# Altium schematic sheet Multiplexers.SchDoc
size A; DocumentNumber: 5; SheetNumber: 5; SheetTotal: 5
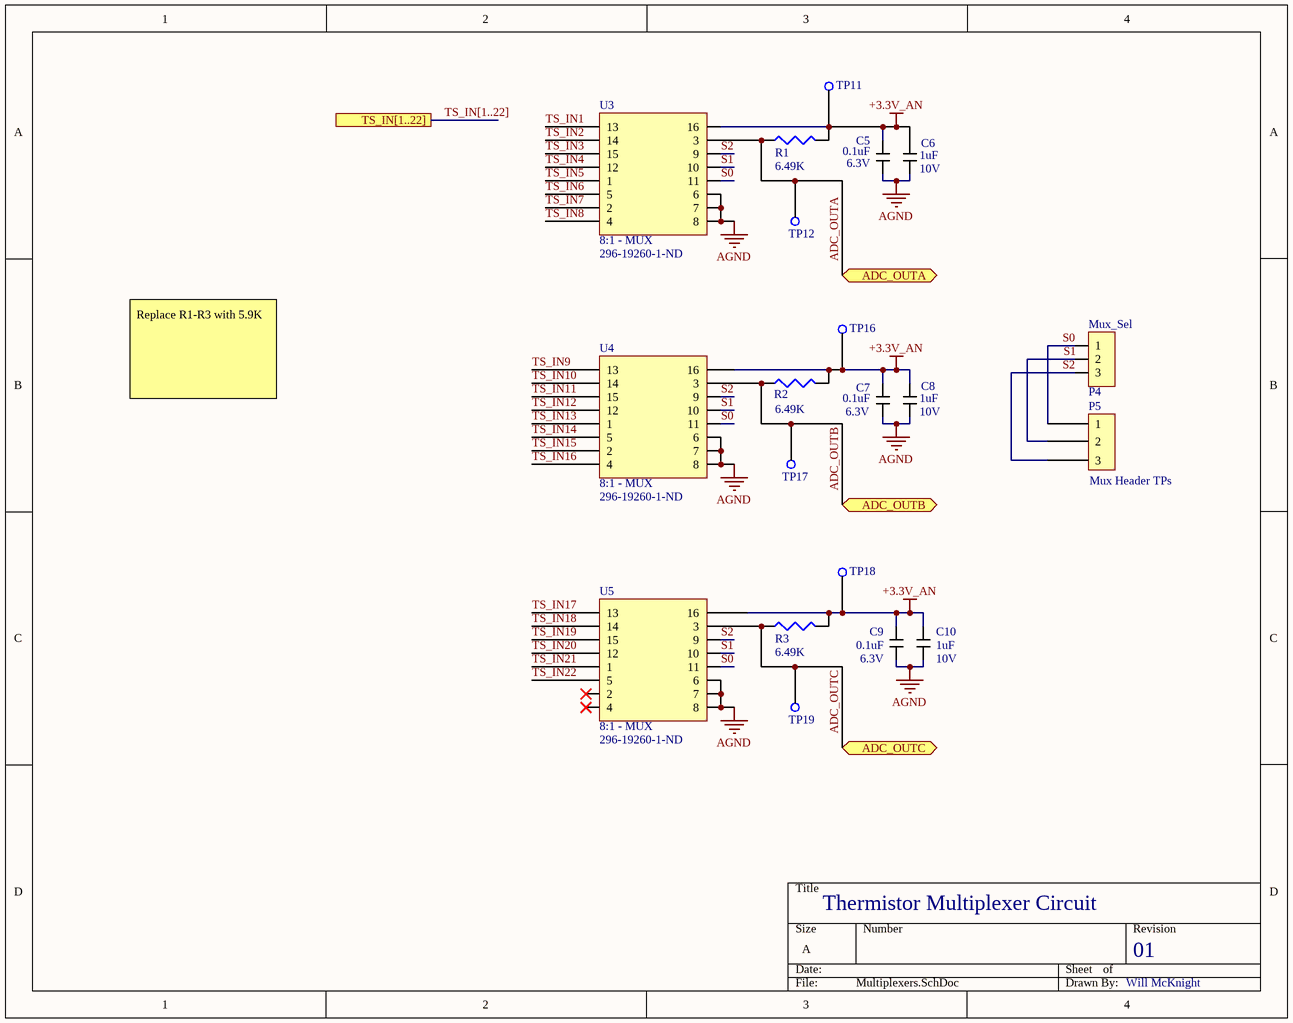
[diagram p0: Multiplexers.SchDoc]

## Parts
C5  0.1uF  Voltage Rating: 6.3V  [0.1uF Bypass Capacitor]
C6  Voltage Rating: 10V  [1uf_Samsung]  (hidden comment: 1uF)
C7  0.1uF  Voltage Rating: 6.3V  [0.1uF Bypass Capacitor]
C8  1uF  [1uf_Samsung]
C9  0.1uF  Voltage Rating: 6.3V  [0.1uF Bypass Capacitor]
C10  Voltage Rating: 10V  [1uf_Samsung]  (hidden comment: 1uF)
P4  Mux_Sel  [3-Screw-terminal-Mux-Select]
P5  3 POS Mux Select Header  [Mux Select 3 Pos Header Pin]  (value not drawn)
R1  Resistance: 6.49K  [RESC2012X06N]  (hidden comment: 6.49kOhm SMD Resistor)
R2  Resistance: 6.49K  [RESC2012X06N]  (hidden comment: 6.49kOhm SMD Resistor)
R3  Resistance: 6.49K  [RESC2012X06N]  (hidden comment: 6.49kOhm SMD Resistor)
TP11  Test Point  [Test Point]  (value not drawn)
TP12  Test Point  [Test Point]  (value not drawn)
TP16  Test Point  [Test Point]  (value not drawn)
TP17  Test Point  [Test Point]  (value not drawn)
TP18  Test Point  [Test Point]  (value not drawn)
TP19  Test Point  [Test Point]  (value not drawn)
U3  8:1 - MUX  Supplier Part Number 1: 296-19260-1-ND  [SOP127P600X175]
U4  8:1 - MUX  Supplier Part Number 1: 296-19260-1-ND  [SOP127P600X175]
U5  8:1 - MUX  Supplier Part Number 1: 296-19260-1-ND  [SOP127P600X175]

## Ports
ADC_OUTA (bidir), ADC_OUTB (bidir), ADC_OUTC (bidir), TS_IN[1..22]

## Nets
+3.3V_AN: C5.2 C6.2 C7.2 C8.2 C9.2 C10.2 R1.2 R2.2 R3.2 TP11.1 TP16.1 TP18.1 U3.16 U4.16 U5.16
AGND: C5.1 C6.1 C7.1 C8.1 C9.1 C10.1 U3.6 U3.7 U3.8 U4.6 U4.7 U4.8 U5.6 U5.7 U5.8
ADC_OUTA: R1.1 TP12.1 U3.3 ; port ADC_OUTA
ADC_OUTB: R2.1 TP17.1 U4.3 ; port ADC_OUTB
ADC_OUTC: R3.1 TP19.1 U5.3 ; port ADC_OUTC
S0: P4.1 P5.1 U3.11 U4.11 U5.11
S1: P4.2 P5.2 U3.10 U4.10 U5.10
S2: P4.3 P5.3 U3.9 U4.9 U5.9
TS_IN1: U3.13
TS_IN2: U3.14
TS_IN3: U3.15
TS_IN4: U3.12
TS_IN5: U3.1
TS_IN6: U3.5
TS_IN7: U3.2
TS_IN8: U3.4
TS_IN9: U4.13
TS_IN10: U4.14
TS_IN11: U4.15
TS_IN12: U4.12
TS_IN13: U4.1
TS_IN14: U4.5
TS_IN15: U4.2
TS_IN16: U4.4
TS_IN17: U5.13
TS_IN18: U5.14
TS_IN19: U5.15
TS_IN20: U5.12
TS_IN21: U5.1
TS_IN22: U5.5

Not connected (* = marked no-connect by the designer): U5 2* 4*

## Buses and harness runs
bus TS_IN[1..22] = port TS_IN[1..22]

## Notes on the sheet
- Replace R1-R3 with 5.9K
- (near C8) 10V
- (near P5) Mux Header TPs
- Thermistor Multiplexer Circuit
- 01
- Will McKnight

## Library data of the parts
C5 C7 C9 = 0.1uF Cap: 0.1uF Bypass Cap; Manufacturer: KEMET; Manufacturer Part Number: C0603C104K9RACTU; Dielectric Material: Ceramic; Tolerance: 10%; Dielectric: X7R; Dissipation Factor: 5%; Supplier 1: Digi-Key; Supplier Part Number 1: 399-15351-1-ND; RoHS: Yes; Mount: Surface Mount; Case/Package: 0603; Case Code (Imperial): 0603; Case Code (Metric): 1608; Min Operating Temperature: -55°C; Max Operating Temperature: 125°C; Package Quantity: 4000; Packaging: Tape and Reel; Voltage Rating (DC): 6.3V; Termination: SMD/SMT; Length: 1.6mm; Height: 0.8mm; Width: 0.8mm; Thickness: 0.034inch; ComponentLink1URL: https://datasheet.ciiva.com/13371/kem-c1002-x7r-smd-357932-13371879.pdf?src-supplier=Mouser; ComponentLink1Description: https://datasheet.ciiva.com/13371/kem-c1002-x7r-smd-357932-13371879.pdf?src-supplier=Mouser; Stock 1: 758; Pricing 1: 1=0.19000, 10=0.13800, 100=0.06480, 500=0.04546, 1000=0.03763 (USD)
C6 C10 = 1uF Samsung Cap: Manufacturer Part Number: CL10B105KP8NNNC; Tolerance: 10%; Dielectric: X7R; Supplier 1: Digi-Key; Supplier Part Number 1: 1276-1946-1-ND; Manufacturer: Samsung; Mount: Surface Mount; Case/Package: 0603; Case Code (Metric): 1608; Case Code (Imperial): 0603; Contact Plating: Tin; Min Operating Temperature: -55°C; Max Operating Temperature: 125°C; Package Quantity: 1; Packaging: Tape and Reel; Voltage Rating (DC): 10V; Length: 1.6mm; Height: 0.8mm; Width: 0.031inch; Thickness: 0.035inch; Depth: 0.8mm; Radiation Hardening: No; Lead Free: Lead Free; ComponentLink1URL: https://media.digikey.com/pdf/Data%20Sheets/Samsung%20PDFs/CL_Series_MLCC_ds.pdf?src-supplier=Digi-Key; ComponentLink1Description: https://media.digikey.com/pdf/Data%20Sheets/Samsung%20PDFs/CL_Series_MLCC_ds.pdf?src-supplier=Digi-Key; ComponentLink2URL: http://www1.futureelectronics.com/doc/SAMSUNG/CL10B105KP8NNNC.pdf?src-supplier=Future+Electronics; ComponentLink2Description: http://www1.futureelectronics.com/doc/SAMSUNG/CL10B105KP8NNNC.pdf?src-supplier=Future+Electronics; ComponentLink3URL: https://www.verical.com/server-webapp/html/getDatasheet?partID=358410&src-supplier=Verical; ComponentLink3Description: https://www.verical.com/server-webapp/html/getDatasheet?partID=358410&src-supplier=Verical; Stock 1: 10781730; Pricing 1: 1=0.1, 10=0.052, 100=0.0233, 500=0.0166, 1000=0.0131 (USD); Capacitance: 1uF
C8 = 1uF Samsung Cap: Manufacturer Part Number: CL10B105KP8NNNC; Tolerance: 10%; Dielectric: X7R; Voltage Rating (DC): 10V; Supplier 1: Digi-Key; Supplier Part Number 1: 1276-1946-1-ND; Manufacturer: Samsung; Mount: Surface Mount; Case/Package: 0603; Case Code (Metric): 1608; Case Code (Imperial): 0603; Contact Plating: Tin; Min Operating Temperature: -55°C; Max Operating Temperature: 125°C; Package Quantity: 1; Packaging: Tape and Reel; Length: 1.6mm; Height: 0.8mm; Width: 0.031inch; Thickness: 0.035inch; Depth: 0.8mm; Radiation Hardening: No; Lead Free: Lead Free; ComponentLink1URL: https://media.digikey.com/pdf/Data%20Sheets/Samsung%20PDFs/CL_Series_MLCC_ds.pdf?src-supplier=Digi-Key; ComponentLink1Description: https://media.digikey.com/pdf/Data%20Sheets/Samsung%20PDFs/CL_Series_MLCC_ds.pdf?src-supplier=Digi-Key; ComponentLink2URL: http://www1.futureelectronics.com/doc/SAMSUNG/CL10B105KP8NNNC.pdf?src-supplier=Future+Electronics; ComponentLink2Description: http://www1.futureelectronics.com/doc/SAMSUNG/CL10B105KP8NNNC.pdf?src-supplier=Future+Electronics; ComponentLink3URL: https://www.verical.com/server-webapp/html/getDatasheet?partID=358410&src-supplier=Verical; ComponentLink3Description: https://www.verical.com/server-webapp/html/getDatasheet?partID=358410&src-supplier=Verical; Stock 1: 10781730; Pricing 1: 1=0.1, 10=0.052, 100=0.0233, 500=0.0166, 1000=0.0131 (USD); Capacitance: 1uF
P4 = 3-Screw-Terminal-Mux-Select: Mux Select; Manufacturer: Wurth Electronics; Manufacturer Part Number: 691103110003; Voltage Rating: 125V; Current Rating: 10A; Number of Levels: 1; Number of Positions Per Level: 3; Wire/Cable Gauge: 26AWG; Pitch: 0.138inch; Stripping Length: -6mm; Supplier 1: Digi-Key; Stock 1: 617; Pricing 1: 1=1.1, 10=0.986, 50=0.851, 100=0.762, 500=0.717, 980=0.672 (USD); Contact Material: Brass; Color: Blue; Housing Material: Nylon; Number of Contacts: 3; Termination: Screw; Length: 7mm; Height: 12.2mm; Width: 11.5mm; REACH SVHC: Unknown; ComponentLink1URL: http://www.farnell.com/datasheets/1442217.pdf?src-supplier=Element14; ComponentLink1Description: http://www.farnell.com/datasheets/1442217.pdf?src-supplier=Element14; Supplier Part Number 1: 732-2746-ND
P5 = 3 POS Mux Select Header: Mux Sel Header TP; Manufacturer: Adam Equipment; Manufacturer Part Number: PH1RA-03-UA; Supplier 1: Digi-Key; Stock 1: 4630; Pricing 1: 1=0.12000, 10=0.11300, 100=0.06960, 500=0.05760, 1000=0.05040, 5000=0.04320, 10000=0.04200 (USD); RoHS: Yes; Lead Free: Lead Free; ComponentLink1URL: https://datasheet.ciiva.com/16476/page-292-295-16476086.pdf?src-supplier=Future+Electronics; ComponentLink1Description: https://datasheet.ciiva.com/16476/page-292-295-16476086.pdf?src-supplier=Future+Electronics; Supplier Part Number 1: 2057-PH1RA-03-UA-ND
R1-R3 = 6.49kOhm SMD Resistor: Manufacturer: Panasonic; Manufacturer Part Number: ERA6AEB6491V; Tolerance: 0.1%; Temperature Coefficient: 25ppm/°C; Power Rating: 125mW; Voltage Rating: 100V; Supplier 1: Digi-Key; Stock 1: 15147; Pricing 1: 1=0.36, 10=0.302, 100=0.1182, 1000=0.0495, 2500=0.0454 (USD); Mount: Surface Mount; Case/Package: 0805; Number of Pins: 2; Contact Plating: Tin; Case Code (Metric): 2012; Case Code (Imperial): 0805; Min Operating Temperature: -55°C; Max Operating Temperature: 155°C; Composition: Thin Film,Metal Film; Packaging: Tape and Reel; Package Quantity: 1; Number of Terminations: 2; Termination: SMD/SMT; Military Standard: Not; Max Power Dissipation: 125mW; Voltage Rating (DC): 100V; Features: Automotive AEC-Q200; Length: 2mm; Height: 0.5mm; Width: 1.25mm; Depth: 1.25mm; Radiation Hardening: No; REACH SVHC: No SVHC; Lead Free: Lead Free; ComponentLink1URL: http://www.farnell.com/datasheets/485442.pdf?src-supplier=Farnell; ComponentLink1Description: http://www.farnell.com/datasheets/485442.pdf?src-supplier=Farnell; ComponentLink2URL: http://www.mouser.com/ds/2/315/AOA0000CE26-32660.pdf?src-supplier=Mouser; ComponentLink2Description: http://www.mouser.com/ds/2/315/AOA0000CE26-32660.pdf?src-supplier=Mouser; ComponentLink3URL: http://www.farnell.com/datasheets/2059650.pdf?src-supplier=Farnell; ComponentLink3Description: http://www.farnell.com/datasheets/2059650.pdf?src-supplier=Farnell; ComponentLink4URL: http://uk.rs-online.com/webdocs/0eb1/0900766b80eb1d8c.pdf?src-supplier=RSComponents; ComponentLink4Description: http://uk.rs-online.com/webdocs/0eb1/0900766b80eb1d8c.pdf?src-supplier=RSComponents; ComponentLink5URL: http://www.farnell.com/datasheets/485442.pdf?src-supplier=Element14; ComponentLink5Description: http://www.farnell.com/datasheets/485442.pdf?src-supplier=Element14; ComponentLink6URL: http://www.produktinfo.conrad.com/datenblaetter/1100000-1199999/001181295-da-01-en-WIDERSTAND_ERA_0805_6K49_0_1__5000ST.pdf?src-supplier=Conrad; ComponentLink6Description: http://www.produktinfo.conrad.com/datenblaetter/1100000-1199999/001181295-da-01-en-WIDERSTAND_ERA_0805_6K49_0_1__5000ST.pdf?src-supplier=Conrad; Supplier Part Number 1: P6.49KDACT-ND
U3-U5 = 8:1 - MUX: Manufacturer: Texas Instruments; Manufacturer Part Number: SN74LV4051ATPWRQ1; Max Supply Voltage: 5.5V; Min Supply Voltage: 2V; Bandwidth: 35MHz; Propagation Delay: 7ns; Number of Channels: 1; Number of Inputs: 8; Logic Function: Multiplexer,Demultiplexer; On-State Resistance: 75R; Operating Supply Current: 20uA; Turn-On Delay Time: 20ns; Supply Type: Single; High Level Output Current: 25mA; Supplier 1: Digi-Key; Stock 1: 41099; Pricing 1: 1=0.73, 10=0.646, 100=0.4951, 500=0.3914, 1000=0.3131 (USD); Mount: Surface Mount; Case/Package: TSSOP; Number of Pins: 16; Weight: 0.002169oz; Contact Plating: Gold; Min Operating Temperature: -40°C; Max Operating Temperature: 105°C; Package Quantity: 1; Packaging: Tape and Reel; Number of Outputs: 1; Turn-Off Delay Time: 20ns; Number of Circuits: 1; Number of Bits: 8; Low Level Output Current: 25mA; Radiation Hardening: No; REACH SVHC: No SVHC; Lead Free: Lead Free; ComponentLink1URL: http://www.ti.com/lit/ds/symlink/sn74lv4051a-q1.pdf?src-supplier=Digi-Key; ComponentLink1Description: http://www.ti.com/lit/ds/symlink/sn74lv4051a-q1.pdf?src-supplier=Digi-Key; ComponentLink2URL: http://www.ti.com/lit/gpn/sn74lv4051a-q1?src-supplier=Mouser; ComponentLink2Description: http://www.ti.com/lit/gpn/sn74lv4051a-q1?src-supplier=Mouser; ComponentLink3URL: https://www.verical.com/server-webapp/html/getDatasheet?partID=137249&src-supplier=Verical; ComponentLink3Description: https://www.verical.com/server-webapp/html/getDatasheet?partID=137249&src-supplier=Verical; ComponentLink4URL: http://focus.ti.com/lit/ds/symlink/sn74lv4051a-q1.pdf?src-supplier=Avnet; ComponentLink4Description: http://focus.ti.com/lit/ds/symlink/sn74lv4051a-q1.pdf?src-supplier=Avnet; ComponentLink5URL: http://www.produktinfo.conrad.com/datenblaetter/1100000-1199999/001187277-da-01-en-IC_MUX_DE_SN74LV4051ATPWRQ1_TSSOP_16_TID.pdf?src-supplier=Conrad; ComponentLink5Description: http://www.produktinfo.conrad.com/datenblaetter/1100000-1199999/001187277-da-01-en-IC_MUX_DE_SN74LV4051ATPWRQ1_TSSOP_16_TID.pdf?src-supplier=Conrad